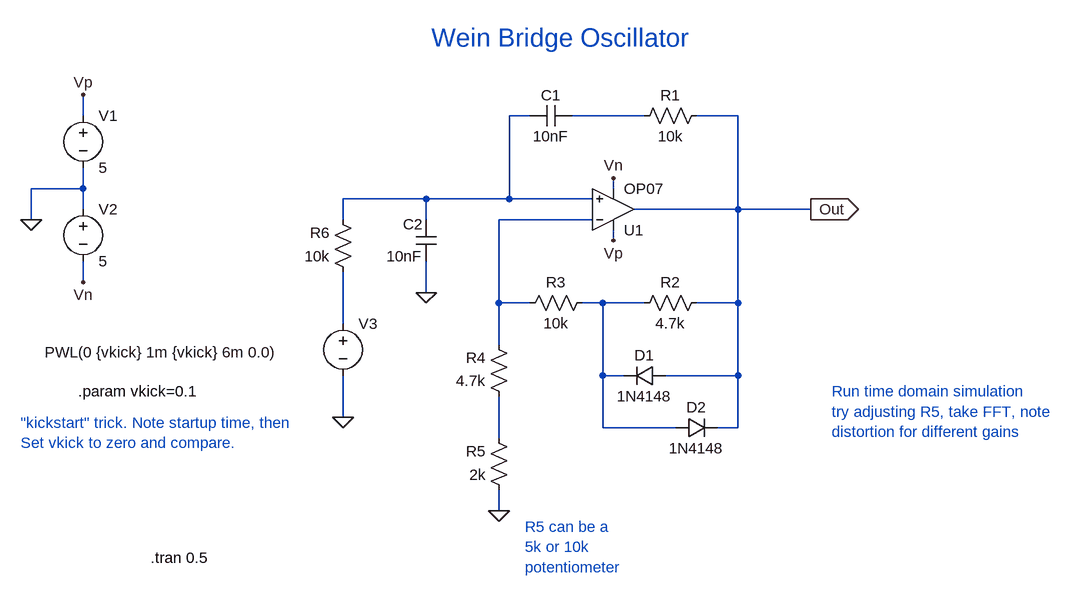
[diagram p0: schematic wien_bridge_osc_complete.asc]
wien_bridge_osc_complete.asc, the LTspice schematic file:
Version 4
SHEET 1 960 800
WIRE -560 96 -560 64
WIRE 128 96 96 96
WIRE 304 96 192 96
WIRE 448 96 384 96
WIRE -560 208 -560 176
WIRE -560 208 -640 208
WIRE 256 208 256 192
WIRE -32 224 -160 224
WIRE 96 224 96 96
WIRE 96 224 -32 224
WIRE 224 224 96 224
WIRE -560 240 -560 208
WIRE 448 240 448 96
WIRE 448 240 288 240
WIRE 560 240 448 240
WIRE -640 256 -640 208
WIRE -160 256 -160 224
WIRE -32 256 -32 224
WIRE 224 256 80 256
WIRE 256 288 256 272
WIRE -560 352 -560 320
WIRE -32 368 -32 320
WIRE 80 384 80 256
WIRE 128 384 80 384
WIRE 240 384 208 384
WIRE 304 384 240 384
WIRE 448 384 448 240
WIRE 448 384 384 384
WIRE -160 416 -160 336
WIRE 80 448 80 384
WIRE 240 496 240 384
WIRE 272 496 240 496
WIRE 448 496 448 384
WIRE 448 496 336 496
WIRE -160 560 -160 496
WIRE 240 576 240 496
WIRE 352 576 240 576
WIRE 448 576 448 496
WIRE 448 576 416 576
WIRE 80 592 80 528
WIRE 80 704 80 672
FLAG -640 256 0
FLAG -560 64 Vp
FLAG 256 288 Vp
FLAG -560 352 Vn
FLAG 256 192 Vn
FLAG -32 368 0
FLAG -160 560 0
FLAG 80 704 0
FLAG 560 240 Out
IOPIN 560 240 Out
SYMBOL Opamps\\OP07 256 304 M180
SYMATTR InstName U1
SYMBOL voltage -560 80 R0
WINDOW 123 0 0 Left 0
WINDOW 39 0 0 Left 0
SYMATTR InstName V1
SYMATTR Value 5
SYMBOL voltage -560 224 R0
WINDOW 123 0 0 Left 0
WINDOW 39 0 0 Left 0
SYMATTR InstName V2
SYMATTR Value 5
SYMBOL res 400 80 R90
WINDOW 0 0 56 VBottom 2
WINDOW 3 32 56 VTop 2
SYMATTR InstName R1
SYMATTR Value 10k
SYMBOL res 400 368 R90
WINDOW 0 0 56 VBottom 2
WINDOW 3 32 56 VTop 2
SYMATTR InstName R2
SYMATTR Value 4.7k
SYMBOL res 224 368 R90
WINDOW 0 0 56 VBottom 2
WINDOW 3 32 56 VTop 2
SYMATTR InstName R3
SYMATTR Value 10k
SYMBOL res 96 544 R180
WINDOW 0 36 76 Left 2
WINDOW 3 36 40 Left 2
SYMATTR InstName R4
SYMATTR Value 4.7k
SYMBOL res 96 688 R180
WINDOW 0 36 76 Left 2
WINDOW 3 36 40 Left 2
SYMATTR InstName R5
SYMATTR Value 2k
SYMBOL cap 192 80 R90
WINDOW 0 0 32 VBottom 2
WINDOW 3 32 32 VTop 2
SYMATTR InstName C1
SYMATTR Value 10nF
SYMBOL cap -48 320 M180
WINDOW 0 -20 57 Left 2
WINDOW 3 -45 8 Left 2
SYMATTR InstName C2
SYMATTR Value 10nF
SYMBOL res -144 352 R180
WINDOW 0 36 76 Left 2
WINDOW 3 36 40 Left 2
SYMATTR InstName R6
SYMATTR Value 10k
SYMBOL diode 336 480 R90
WINDOW 0 0 32 VBottom 2
WINDOW 3 32 32 VTop 2
SYMATTR InstName D1
SYMATTR Value 1N4148
SYMBOL diode 352 592 R270
WINDOW 0 32 32 VTop 2
WINDOW 3 0 32 VBottom 2
SYMATTR InstName D2
SYMATTR Value 1N4148
SYMBOL voltage -160 400 R0
WINDOW 3 -459 60 Left 2
WINDOW 123 0 0 Left 0
WINDOW 39 0 0 Left 0
SYMATTR Value PWL(0 {vkick} 1m {vkick} 6m 0.0)
SYMATTR InstName V3
TEXT -456 776 Left 2 !.tran 0.5
TEXT -656 568 Left 2 ;"kickstart" trick. Note startup time, then\nSet vkick to zero and compare.
TEXT -568 520 Left 2 !.param vkick=0.1
TEXT -24 -24 Left 4 ;Wein Bridge Oscillator
TEXT 592 520 Left 2 ;Run time domain simulation\ntry adjusting R5, take FFT, note\ndistortion for different gains
TEXT 120 728 Left 2 ;R5 can be a\n5k or 10k\npotentiometer

The netlist it stands for:
* wien_bridge_osc_complete.asc
XU1 N001 N003 Vp Vn Out LT1001  ; OP07, pins In+ In- V+ V- OUT
V1 Vp 0 5
V2 0 Vn 5
R1 Out N002 10k
R2 Out N004 4.7k
R3 N004 N003 10k
R4 N006 N003 4.7k
R5 0 N006 2k
C1 N002 N001 10nF
C2 0 N001 10nF
R6 N005 N001 10k
D1 Out N004 1N4148
D2 N004 Out 1N4148
V3 N005 0 PWL(0 {vkick} 1m {vkick} 6m 0.0)
.model D D
.lib standard.dio
.tran 0.5
* "kickstart" trick. Note startup time, then
* Set vkick to zero and compare.
.param vkick=0.1
* Wein Bridge Oscillator
* Run time domain simulation
* try adjusting R5, take FFT, note
* distortion for different gains
* R5 can be a
* 5k or 10k
* potentiometer
.lib LTC.lib
.backanno
.end